# Altium schematic sheet PWR.SchDoc: Power
size A3
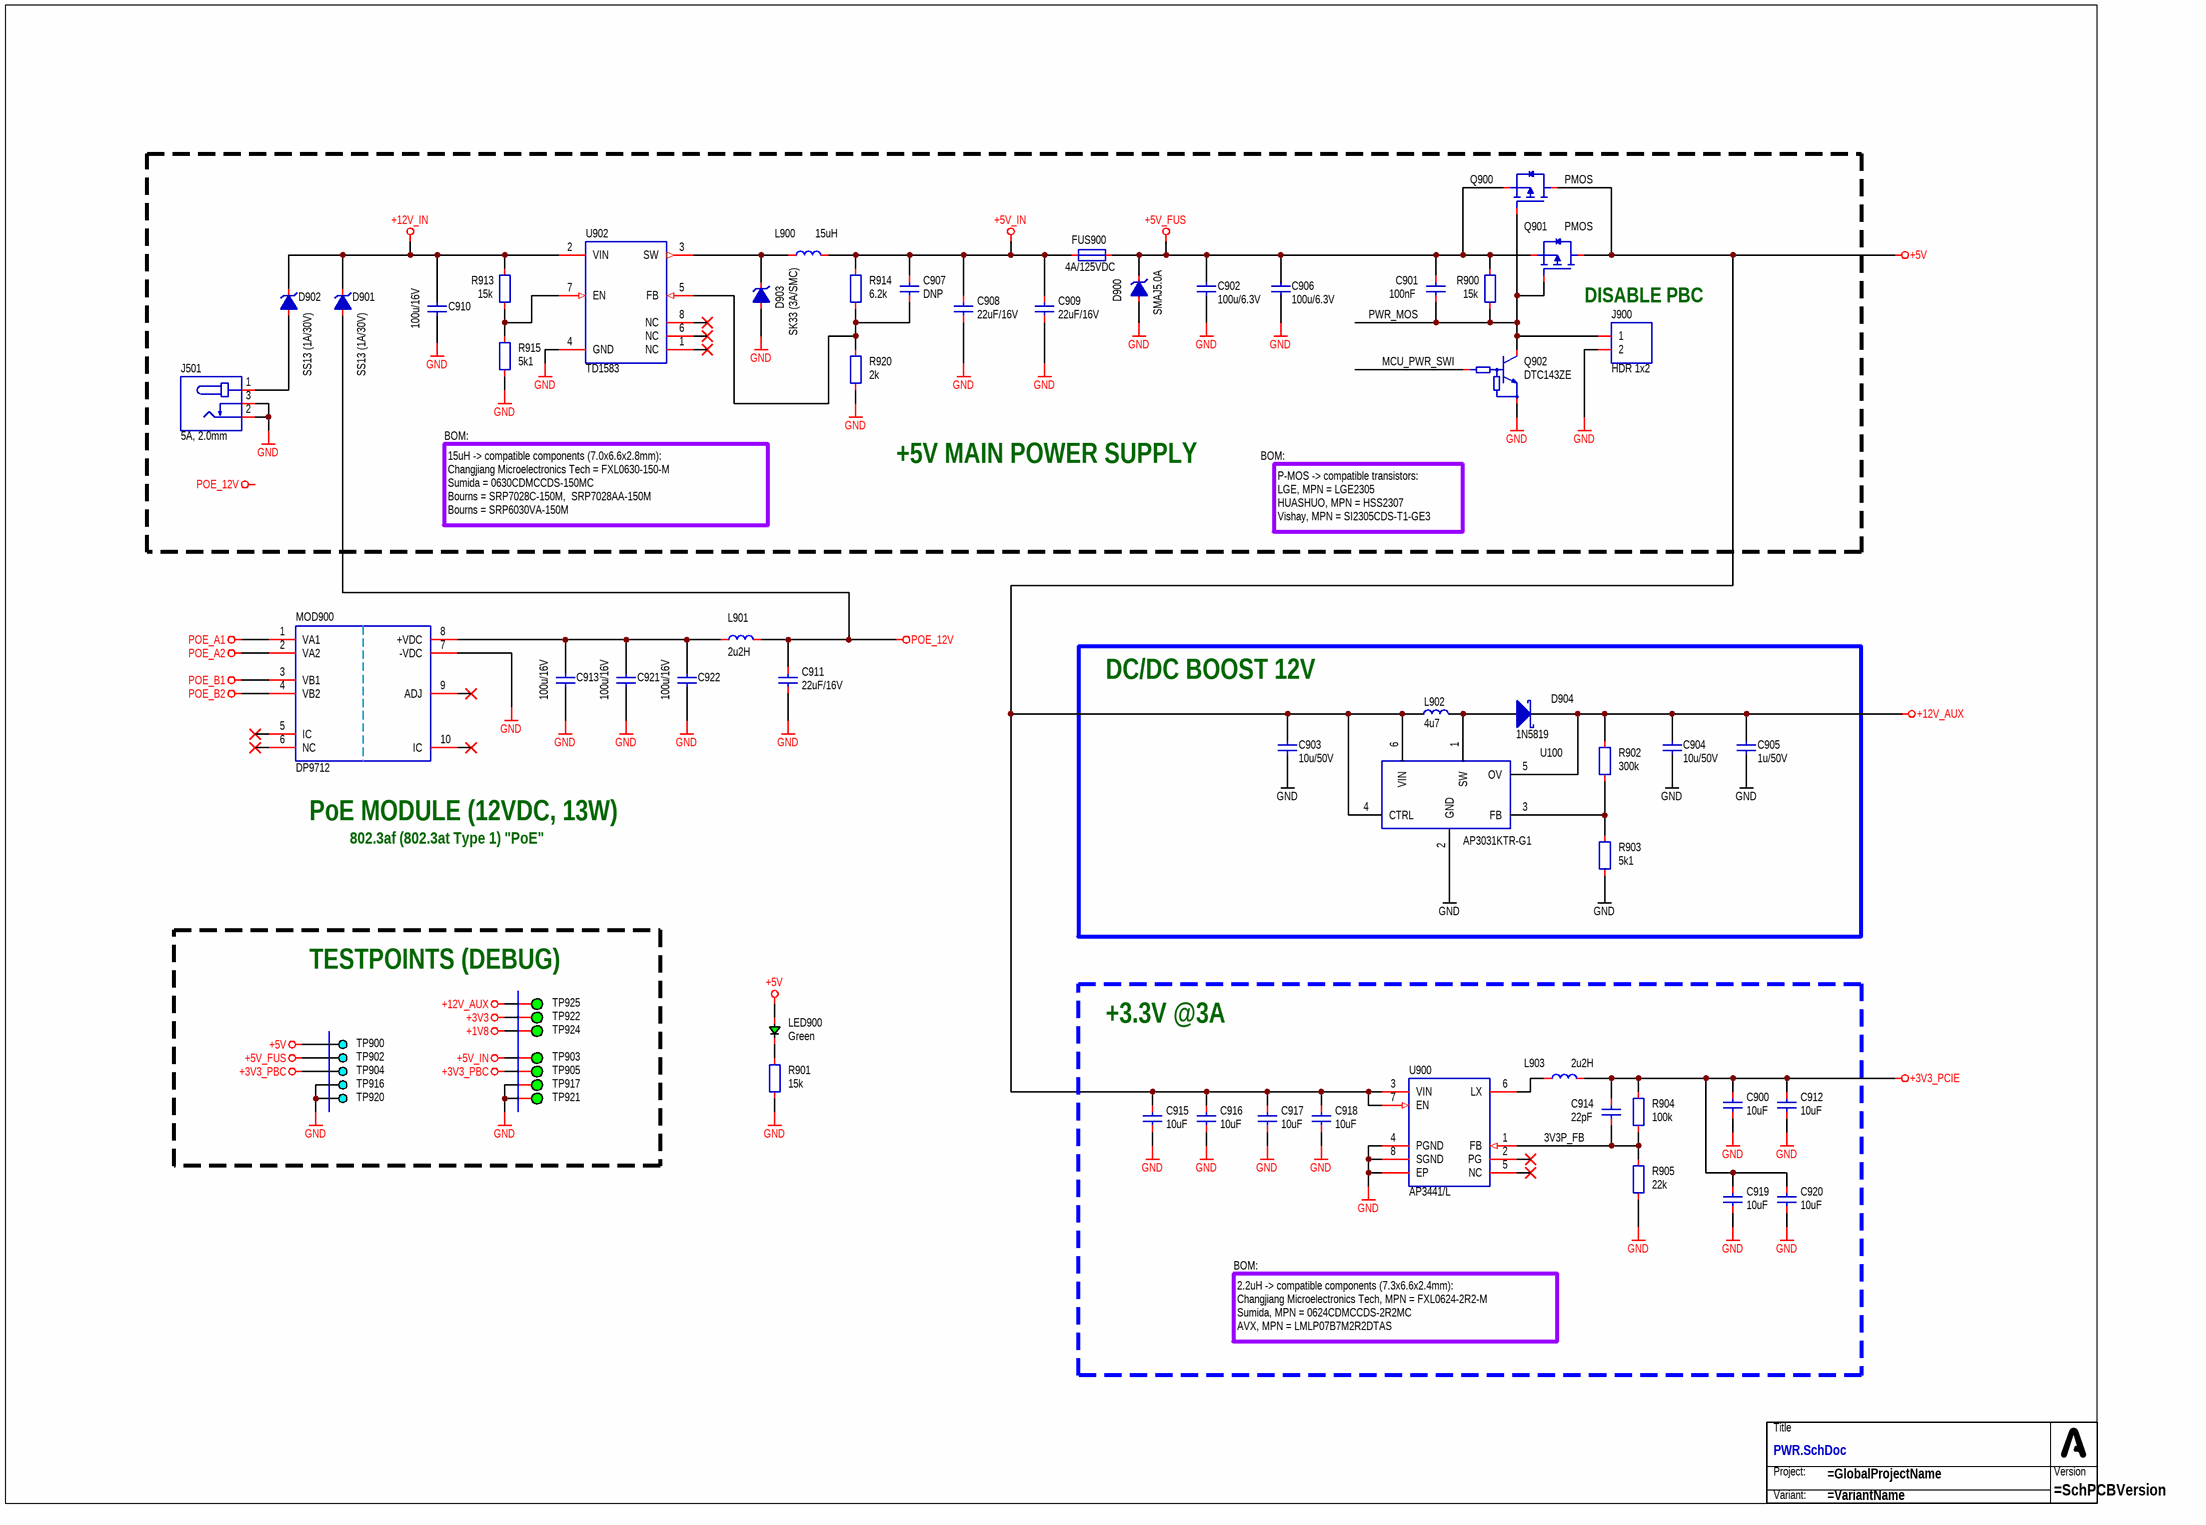
[diagram p0: PWR.SchDoc]

## Parts
C900  10uF  [CAP_0603_R]
C901  100nF  [CAP_0603_R]
C902  100u/6.3V  [CAP_1206_H190_R]
C903  10u/50V  [CAP_1206_H190_R]
C904  10u/50V  [CAP_1206_H190_R]
C905  1u/50V  [CAP_0603_R]
C906  100u/6.3V  [CAP_1206_H190_R]
C907  DNP  [CAP_0603_R]
C908  22uF/16V  [CAP_0805_R]
C909  22uF/16V  [CAP_0805_R]
C910  100u/16V  [CAP_1210_H280_R]
C911  22uF/16V  [CAP_0805_R]
C912  10uF  [CAP_0603_R]
C913  100u/16V  [CAP_1210_H280_R]
C914  22pF  [CAP_0603_R]
C915  10uF  [CAP_0603_R]
C916  10uF  [CAP_0603_R]
C917  10uF  [CAP_0603_R]
C918  10uF  [CAP_0603_R]
C919  10uF  [CAP_0603_R]
C920  10uF  [CAP_0603_R]
C921  100u/16V  [CAP_1210_H280_R]
C922  100u/16V  [CAP_1210_H280_R]
D900  SMAJ5.0A  [DIO_SMA_UNI_R]
D901  SS13 (1A/30V)  [DIO_SMA_UNI_R]
D902  SS13 (1A/30V)  [DIO_SMA_UNI_R]
D903  SK33 (3A/SMC)  [DIO_SMC_UNI_R]
D904  1N5819  [DIO_SOD-323_R]
FUS900  4A/125VDC  [FUS_2410_R]
J501  5A, 2.0mm  [CON_XKB_DC-005-5A-2.0]
J900  HDR 1x2  [CON_HDR_P254_1X02_STR]
L900  15uH  [IND_SUM_0630CDMCCDS_700X660X280_R]
L901  2u2H  [IND_SUM_0624CDMCCDS_700X660X240_R]
L902  4u7  [IND_POWER_0402_R]
L903  2u2H  [IND_SUM_0624CDMCCDS_700X660X240_R]
LED900  Green  [LED_0805_GRN_R]
MOD900  DP9712  [MOD_SDP_DP9700]
Q900  PMOS  [PKG_SOT23-3_TO236]
Q901  PMOS  [PKG_SOT23-3_TO236]
Q902  DTC143ZE  [PKG_SOT523_SC75_SOT416_P100_R]
R900  15k  [RES_0603_R]
R901  15k  [RES_0603_R]
R902  300k  [RES_0603_R]
R903  5k1  [RES_0603_R]
R904  100k  [RES_0603_R]
R905  22k  [RES_0603_R]
R913  15k  [RES_0603_R]
R914  6.2k  [RES_0603_R]
R915  5k1  [RES_0603_R]
R920  2k  [RES_0603_R]
TB?  (no value)  (no BOM)
TP900  DEBUG  [PCB_TP_DBG_50]  (value not drawn)  (no BOM)
TP902  DEBUG  [PCB_TP_DBG_50]  (value not drawn)  (no BOM)
TP903  ICT  [PCB_TP_ICT_100]  (value not drawn)  (no BOM)
TP904  DEBUG  [PCB_TP_DBG_50]  (value not drawn)  (no BOM)
TP905  ICT  [PCB_TP_ICT_100]  (value not drawn)  (no BOM)
TP916  DEBUG  [PCB_TP_DBG_50]  (value not drawn)  (no BOM)
TP917  ICT  [PCB_TP_ICT_100]  (value not drawn)  (no BOM)
TP920  DEBUG  [PCB_TP_DBG_50]  (value not drawn)  (no BOM)
TP921  ICT  [PCB_TP_ICT_100]  (value not drawn)  (no BOM)
TP922  ICT  [PCB_TP_ICT_100]  (value not drawn)  (no BOM)
TP924  ICT  [PCB_TP_ICT_100]  (value not drawn)  (no BOM)
TP925  ICT  [PCB_TP_ICT_100]  (value not drawn)  (no BOM)
U100  AP3031KTR-G1  [PKG_SOT23-6_R]
U900  AP3441/L  [ICC_DFN8_200X200X90P50_EP_R]
U902  TD1583  [ICC_SO8_SOP8_490X390X160_P127_R]

## Blocks framed on the sheet
DC/DC BOOST 12V: C903-C905 D904 L902 R902 R903 U100

## Nets
+1V8: TP924.1
+3V3: TP922.1
+3V3_PBC: TP904.1 TP905.1
+3V3_PCIE: C900.2 C912.2 C914.2 C919.2 C920.2 L903.2 R904.2
+5V: C903.2 C915.2 C916.2 C917.2 C918.2 L902.1 LED900.2 Q900.3(D) Q901.3(D) TP900.1 U100.4(CTRL) U100.6(VIN) U900.3(VIN) U900.7(EN)
+5V_FUS: C901.2 C902.2 C906.2 D900.1(K) FUS900.2 Q900.2(S) Q901.2(S) R900.2 TP902.1
+5V_IN: C907.2 C908.2 C909.2 FUS900.1 L900.2 R914.2 TP903.1
+12V_AUX: C904.2 C905.1 D904.K R902.1 TP925.1 U100.5(OV)
+12V_IN: C910.2 D901.1(K) D902.1(K) R913.2 U902.2(VIN)
GND: C900.1 C902.1 C903.1 C904.1 C905.2 C906.1 C908.1 C909.1 C910.1 C911.1 C912.1 C913.1 C915.1 C916.1 C917.1 C918.1 C919.1 C920.1 C921.1 C922.1 D900.2(A) D903.2(A) J501.2 J501.3 J900.2 MOD900.7(-VDC) Q902.2(E) R901.1 R903.2 R905.1 R915.2 R920.2 TP916.1 TP917.1 TP920.1 TP921.1 U100.2(GND) U900.4(PGND) U900.8(SGND) U900.EP U902.4(GND)
POE_12V: C911.2 D901.2(A) L901.2
POE_A1: MOD900.1(VA1)
POE_A2: MOD900.2(VA2)
POE_B1: MOD900.3(VB1)
POE_B2: MOD900.4(VB2)
3V3P_FB: C914.1 R904.1 R905.2 U900.1(FB)
MCU_PWR_SWI: Q902.1(B)
PWR_MOS: C901.1 J900.1 Q900.1(G) Q901.1(G) Q902.3(C) R900.1
NetC907_1: C907.1 R914.1 R920.1 U902.5(FB)
NetC913_2: C913.2 C921.2 C922.2 L901.1 MOD900.8(+VDC)
NetD902_2: D902.2(A) J501.1
NetD903_1: D903.1(K) L900.1 U902.3(SW)
NetD904_A: D904.A L902.2 U100.1(SW)
NetL903_1: L903.1 U900.6(LX)
NetLED900_1: LED900.1 R901.2
NetR902_2: R902.2 R903.1 U100.3(FB)
NetR913_1: R913.1 R915.1 U902.7(EN)

Not connected (* = marked no-connect by the designer): MOD900 5(IC)* 6(NC)* 9(ADJ)* 10(IC)*; U900 2(PG)* 5(NC)*; U902 1(NC)* 6(NC)* 8(NC)*

## Notes on the sheet
- (near Q901) DISABLE PBC
- BOM:
- +5V MAIN POWER SUPPLY
- 15uH -> compatible components (7.0x6.6x2.8mm):
  Changjiang Microelectronics Tech = FXL0630-150-M
  Sumida = 0630CDMCCDS-150MC
  Bourns = SRP7028C-150M,  SRP7028AA-150M
  Bourns = SRP6030VA-150M
- P-MOS -> compatible transistors:
  LGE, MPN = LGE2305
  HUASHUO, MPN = HSS2307
  Vishay, MPN = SI2305CDS-T1-GE3
- (near MOD900) PoE MODULE (12VDC, 13W)
- 802.3af (802.3at Type 1) "PoE"
- TESTPOINTS (DEBUG)
- +3.3V @3A
- 2.2uH -> compatible components (7.3x6.6x2.4mm):
  Changjiang Microelectronics Tech, MPN = FXL0624-2R2-M
  Sumida, MPN = 0624CDMCCDS-2R2MC
  AVX, MPN = LMLP07B7M2R2DTAS
- Labels drawn without touching a wire or pin: POE_12V
- (in symbol SCH_TITLE_BLOCK_SIMPLE_NODATE) Title; Project:; Version; Variant:

## Library data of the parts
C900 C912 C915-C920 = CAP-0023: CAP SMD 10u/10V ±10% 10V X5R (0603); Manufacturer: Samsung Electro-Mechanics; MPN: CL10A106KP8NNNC; Component Subtype: MLCC; Package (Case): 0603; Component Type: Capacitor; Value: 10uF; Mounting Type: SMD
C901 = CAP-0008: Capacitor; MLCC; 100nF; 10V X5R; Manufacturer: YAGEO; MPN: CC0603KRX7R9BB104; Package (Case): 0603; Component Type: Capacitor; Component Subtype: MLCC; Value: 100nF; Mounting Type: SMD
C902 C906 = ITEM_C10039: CAP SMD 100u/6.3V ±20% 6.3V X5R (1206); Manufacturer: Samsung Electro-Mechanics; MPN: CL31A107MQHNNNE; Component Subtype: MLCC; Package (Case): 1206; Component Type: Capacitor; Mounting Type: SMD; Value: 100u/6.3V
C903 C904 = ITEM_C10004: CAP SMD 10u/50V ±10% 50V X5R (1206); Manufacturer: Samsung Electro-Mechanics; MPN: CL31A106KBHNNNE; Component Subtype: MLCC; Package (Case): 1206; Component Type: Capacitor; Mounting Type: SMD; Value: 10u/50V
C905 = ITEM_C10014: CAP SMD 1u/50V ±10% 50V X5R (0603); Manufacturer: Samsung Electro-Mechanics; MPN: CL10A105KB8NNNC; Component Subtype: MLCC; Package (Case): 0603; Component Type: Capacitor; Mounting Type: SMD; Value: 1u/50V
C907 = CAP-0018: Component Subtype: MLCC; Package (Case): 0603; Component Type: Capacitor; Value: DNP; Mounting Type: SMD
C908 C909 C911 = CAP-0024: Capacitor; MLCC; 22u 16V; Manufacturer: Samsung Electro-Mechanics; MPN: CL21A226MOQNNNE; Package (Case): 0805; Component Type: Capacitor; Component Subtype: MLCC; Value: 22uF/16V; Mounting Type: SMD
C910 C913 C921 C922 = ITEM_C10033: CAP SMD 100u/16V ±20% 16V X5R (1210); Manufacturer: Chinocera; MPN: HGC1210R5107M160NSVK; Component Subtype: MLCC; Package (Case): 1210; Value: 100uF; Component Type: Capacitor; Mounting Type: SMD
C914 = CAP-0023: Capacitor; MLCC; 22p 50V; Manufacturer: Samsung Electro-Mechanics; MPN: CL10C220JB8NNNC; Package (Case): 0603; Component Type: Capacitor; Component Subtype: MLCC; Value: 22pF; Mounting Type: SMD
D900 = DIO_TVS_UNI_KA: Diode; Schottky; Unipolar; SMAj5.0A; Manufacturer: Littelfuse; Component Subtype: TVS Diode; Package (Case): SMA; Value: SMAJ5.0A; MPN: SMAJ5.0A; Component Type: Diode; Mounting Type: SMD
D901 D902 = DIO_TVS_UNI_KA: Diode; Schottky; Unipolar; SS13; Manufacturer: ON Semi; Component Subtype: TVS Diode; Package (Case): DO-214AC (SMA); Value: SS13 (1A/30V); MPN: SS13; Component Type: Diode; Mounting Type: SMD
D903 = DIO_TVS_UNI_KA: Diode; Schottky; Unipolar; SK33; Manufacturer: Littelfuse; Component Subtype: TVS Diode; Package (Case): SMC; Value: SK33 (3A/SMC); MPN: SK33; Component Type: Diode; Mounting Type: SMD
D904 = ITEM_D10006: DIODE SMD / SCHOTTKY / 40V 1A 600mV @ 1A  (SOD-323); Manufacturer: Guangdong Hottech; MPN: 1N5819WS; Package (Case): SOD-323
FUS900 = FUS: Fuse 4A; Manufacturer: Bel Fuse; MPN: 0679L4000-01; Package (Case): SMD,6.1x2.5mm; Value: 4A/125VDC; Mounting Type: SMD
J501 = CON_XKB_DC-005-5A-2.0: Connector; DC Barrel Jack;; Manufacturer: XKB Connectivity; Package (Case): THT; Component Subtype: DC Barrel Jack; Component Type: Connector; Mounting Type: THT; MPN: DC-005-5A-2.0; Value: 5A, 2.0mm
J900 = CON-0020: CONN THT / HEADER / PITCH 2,54mm / VERTICAL / (2 PIN); Manufacturer: Ckmtw(Shenzhen Cankemeng); MPN: B-2100S02P-A110; Component Subtype: Pin Header; Component Type: Connector; Value: HDR 1x2; Mounting Type: THT; Package (Case): THT
L900 = IND: Inductor; 15u; Manufacturer: Changjiang Microelectronics Tech; MPN: FXL0630-150-M; Component Subtype: Power Inductor; Package (Case): SMD; Value: 15uH; Component Type: Inductor; Mounting Type: SMD
L901 L903 = IND: Inductor; 2u2; Manufacturer: Changjiang Microelectronics Tech; MPN: FXL0624-2R2-M; Component Subtype: Power Inductor; Package (Case): SMD; Value: 2u2H; Component Type: Inductor; Mounting Type: SMD
L902 = ITEM_L10009: INDUCTOR SMD COIL / 4u7 ±20% / Power inductor Ir 2.8A Isat 3A (SMD,4.2x4.4mm); Manufacturer: cjiang (Changjiang Microelectronics Tech); MPN: FXL0420-4R7-M; Component Subtype: Power Inductor; Component Type: Inductor; Mounting Type: SMD; Package (Case): SMD,4.2x4.4mm; Value: 4u7
LED900 = DIO_LED_GRN: Diode; LED; Green;; Manufacturer: Foshan NationStar Optoelectronics; MPN: NCD0805G1; Component Subtype: LED Diode; Package (Case): 0805; Value: Green; Component Type: LED; Mounting Type: SMD
MOD900 = MOD_SDP_DP9700: PCB Module; PoE Module;; Manufacturer: SDaPo; Component Type: PCB Module; Mounting Type: THT; MPN: DP9712; Value: DP9712
Q900 Q901 = TRA_PMOS_GSD: Transistor; PMOS;; Manufacturer: Vishay; MPN: SI2305CDS-T1-GE3; Component Subtype: P-MOSFET; Package (Case): SOT23; Value: PMOS; Component Type: Transistor; Mounting Type: SMD
Q902 = TRA_BJT_NPN_DIG_BEC: Transistor; BJT; NPN; Digital;; Manufacturer: On Semiconductor; Component Subtype: NPN Transistor; Package (Case): SOT-523; Value: DTC143ZE; MPN: DTC143ZE; Component Type: Transistor; Mounting Type: SMD
R900 R901 R913 = RES-0043: Resistor; Thick Film; 15k; 1%; 100mW; 100PPM; 75V; Standard; SMD; 0603 (1608);; Manufacturer: UNI-ROYAL(Uniroyal Elec); MPN: 0603WAF1502T5E; Package (Case): 0603; Component Type: Resistor; Component Subtype: Thick Film; Value: 15k; Mounting Type: SMD
R902 = RES-0043: Resistor; Thick Film; 5k1; 1%; 100mW; 100PPM; 75V; Standard; SMD; 0603 (1608);; Manufacturer: UNI-ROYAL(Uniroyal Elec); MPN: 0603WAF3003T5E; Package (Case): 0603; Component Type: Resistor; Component Subtype: Thick Film; Value: 300k; Mounting Type: SMD
R903 R915 = RES-0043: Resistor; Thick Film; 5k1; 1%; 100mW; 100PPM; 75V; Standard; SMD; 0603 (1608);; Manufacturer: UNI-ROYAL(Uniroyal Elec); MPN: 0603WAF5101T5E; Package (Case): 0603; Component Type: Resistor; Component Subtype: Thick Film; Value: 5k1; Mounting Type: SMD
R904 = RES-0029: Resistor; Thick Film; 100k; 1%; 100mW; 100PPM; 75V; Standard; SMD; 0603 (1608);; Manufacturer: UNI-ROYAL(Uniroyal Elec); MPN: 0603WAF1003T5E; Package (Case): 0603; Component Type: Resistor; Component Subtype: Thick Film; Value: 100k; Mounting Type: SMD
R905 = RES-0034: Resistor; Thick Film; 22k; 1%; 100mW; 100PPM; 75V; Standard; SMD; 0603 (1608);; Manufacturer: UNI-ROYAL(Uniroyal Elec); MPN: 0603WAF2202T5E; Package (Case): 0603; Component Type: Resistor; Component Subtype: Thick Film; Value: 22k; Mounting Type: SMD
R914 = RES-0054: Resistor; Thick Film; 6k2; SMD; 0603 (1608);; Manufacturer: UNI-ROYAL(Uniroyal Elec); MPN: 0603WAF6201T5E; Package (Case): 0603; Component Type: Resistor; Component Subtype: Thick Film; Value: 6.2k; Mounting Type: SMD
R920 = RES-0033: Resistor; Thick Film; 2k2; 1%; 100mW; 100PPM; 75V; Standard; SMD; 0603 (1608);; Manufacturer: UNI-ROYAL(Uniroyal Elec); MPN: 0603WAF2001T5E; Package (Case): 0603; Component Type: Resistor; Component Subtype: Thick Film; Value: 2k; Mounting Type: SMD
TB? = SCH_TITLE_BLOCK_SIMPLE_NODATE
TP900 TP902 TP904 TP916 TP920 = PCB_TP_DBG: PCB Marking; Test Point (Debug);; Value: DEBUG; Component Type: Testpoint
TP903 TP905 TP917 TP921 TP922 TP924 TP925 = PCB_TP_ICT: Test Point (ICT); Component Type: Testpoint (for ICT); Mounting Type: Non component; Value: ICT
U100 = ITEM_U10019: IC SMD / REGULATOR - CONVERTER (INT SWI) - DC/DC - STEP-UP / 1.4A 2.7-16VIN 1MHz (SOT-23-6); Manufacturer: Diodes Incorporated; MPN: AP3031KTR-G1; Package (Case): SOT-23-6
U900 = ICC_DDS_AP3441/L_DFN2020-8: IC; Buck regulator; AP3441; Manufacturer: Diodes Incorporated; MPN: AP3441SHE-7B; Package (Case): U-DFN2020-8; Component Type: IC; Mounting Type: SMD; Value: AP3441/L
U902 = ICC_TCH_TD1583_SOP8: IC; Buck regulator; TD1583; Manufacturer: Techcode Semicon; MPN: TD1583PR; Package (Case): SOP8; Component Type: IC; Mounting Type: SMD; Value: TD1583